# Altium schematic sheet charging_board.SchDoc
size A4; SheetNumber: 1; SheetTotal: 1
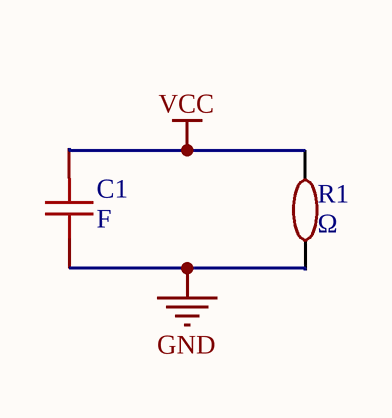
[diagram p0: charging_board.SchDoc]

## Parts
C1  F  [0603]
R1  Ω  [0603]

## Nets
GND: C1.1 R1.1
VCC: C1.2 R1.2

## Library data of the parts
C1 = C0603: 0603封装电容
R1 = R0603: 0603封装电阻